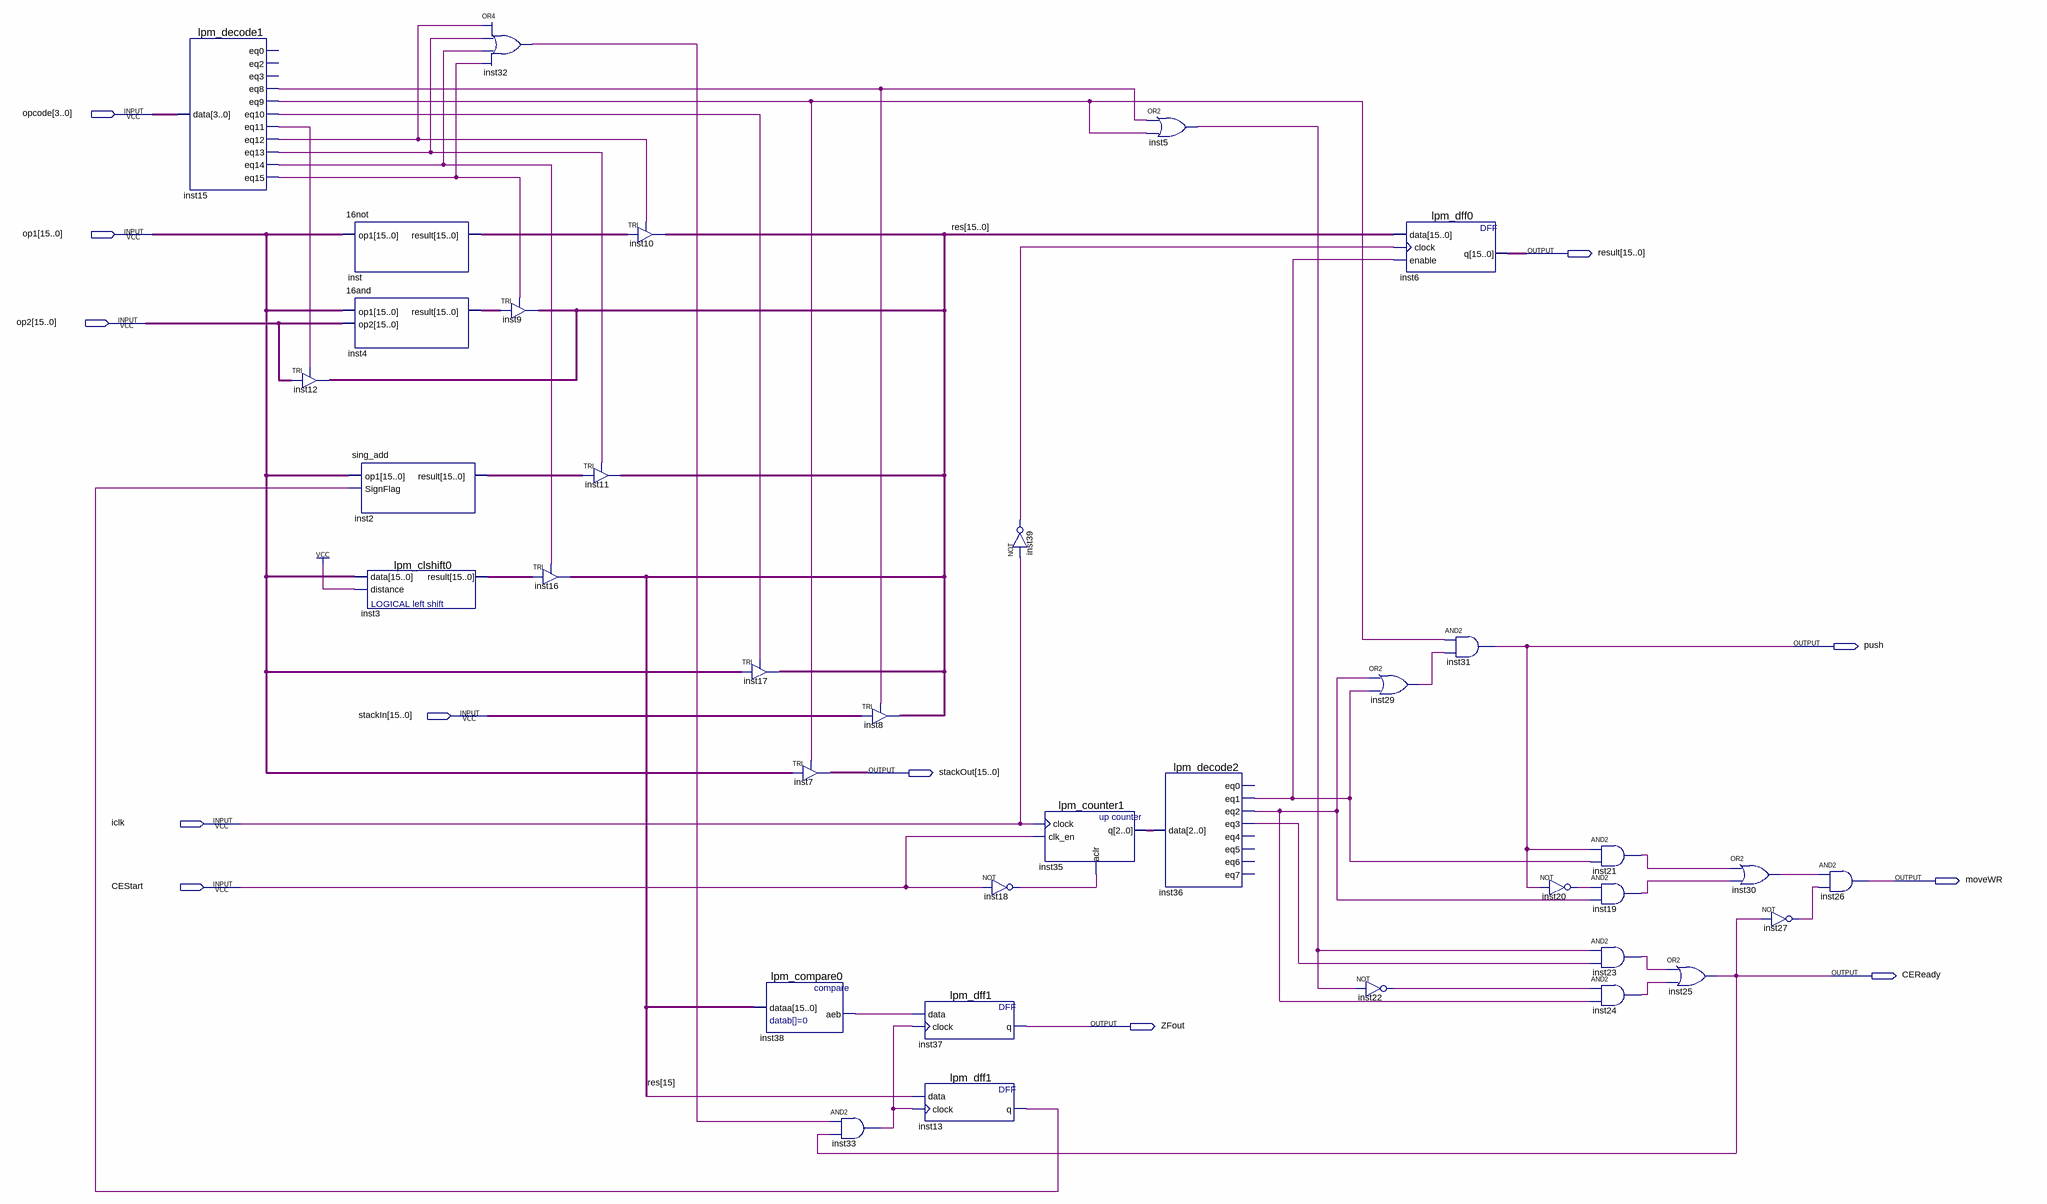
[diagram p0: schematic sheet]
// Quartus schematic ALU.bdf as structural Verilog: 36 symbols, 12 pins
module ALU (
  input  [3:0] opcode,
  input  [15:0] op1,
  input  [15:0] op2,
  input  [15:0] stackIn,
  input  iclk,
  input  CEStart,
  output [15:0] result,
  output push,
  output [15:0] stackOut,
  output moveWR,
  output CEReady,
  output ZFout
);

  wire inst5_out, inst13_q, inst15_eq8, inst15_eq9, inst15_eq10, inst15_eq11, inst15_eq12, inst15_eq13,
       inst15_eq14, inst15_eq15, inst18_out, inst19_out, inst20_out, inst21_out, inst22_out, inst23_out,
       inst24_out, inst27_out, inst29_out, inst30_out, inst32_out, inst33_out, inst36_eq1, inst36_eq2,
       inst36_eq3, inst38_aeb, inst39_out;
  wire [2:0] inst35_q;
  wire [15:0] inst2_result, inst3_result, inst4_result, inst_result, res;

  lpm_decode1 inst15 (
    .data(opcode), .eq8(inst15_eq8), .eq9(inst15_eq9), .eq10(inst15_eq10), .eq11(inst15_eq11),
    .eq12(inst15_eq12), .eq13(inst15_eq13), .eq14(inst15_eq14), .eq15(inst15_eq15));  // open: eq0, eq2, eq3
  TRI inst12[15:0] (.IN(op2), .OE(inst15_eq11), .OUT(res));
  \16not  inst (.op1(op1), .result(inst_result));
  \16and  inst4 (.op1(op1), .op2(op2), .result(inst4_result));
  sing_add inst2 (.op1(op1), .SignFlag(inst13_q), .result(inst2_result));
  lpm_clshift0 inst3 (.data(op1), .distance(1'b1), .result(inst3_result));
  or inst32 (inst32_out, inst15_eq12, inst15_eq13, inst15_eq14, inst15_eq15);
  TRI inst9[15:0] (.IN(inst4_result), .OE(inst15_eq15), .OUT(res));
  TRI inst16[15:0] (.IN(inst3_result), .OE(inst15_eq14), .OUT(res));
  TRI inst11[15:0] (.IN(inst2_result), .OE(inst15_eq13), .OUT(res));
  TRI inst10[15:0] (.IN(inst_result), .OE(inst15_eq12), .OUT(res));
  TRI inst17[15:0] (.IN(op1), .OE(inst15_eq10), .OUT(res));
  lpm_compare0 inst38 (.dataa(res), .aeb(inst38_aeb));
  TRI inst7[15:0] (.IN(op1), .OE(inst15_eq9), .OUT(stackOut));
  and inst33 (inst33_out, inst32_out, CEReady);
  TRI inst8[15:0] (.IN(stackIn), .OE(inst15_eq8), .OUT(res));
  lpm_dff1 inst37 (.data(inst38_aeb), .clock(inst33_out), .q(ZFout));
  lpm_dff1 inst13 (.data(res[15]), .clock(inst33_out), .q(inst13_q));
  not inst18 (inst18_out, CEStart);
  not inst39 (inst39_out, iclk);
  lpm_counter1 inst35 (.clock(iclk), .clk_en(CEStart), .aclr(inst18_out), .q(inst35_q));
  or inst5 (inst5_out, inst15_eq8, inst15_eq9);
  lpm_decode2 inst36 (
    .data(inst35_q), .eq1(inst36_eq1), .eq2(inst36_eq2), .eq3(inst36_eq3));  // open: eq0, eq4, eq5, eq6, eq7
  lpm_dff0 inst6 (.data(res), .clock(inst39_out), .enable(inst36_eq1), .q(result));
  or inst29 (inst29_out, inst36_eq2, inst36_eq1);
  not inst22 (inst22_out, inst5_out);
  and inst31 (push, inst15_eq9, inst29_out);
  not inst20 (inst20_out, push);
  and inst21 (inst21_out, push, inst36_eq1);
  and inst19 (inst19_out, inst20_out, inst36_eq2);
  and inst23 (inst23_out, inst5_out, inst36_eq3);
  and inst24 (inst24_out, inst22_out, inst36_eq2);
  or inst25 (CEReady, inst23_out, inst24_out);
  or inst30 (inst30_out, inst21_out, inst19_out);
  not inst27 (inst27_out, CEReady);
  and inst26 (moveWR, inst30_out, inst27_out);
endmodule
